# EAGLE schematic qPCR_pcb_breakout_LME49721MAX:NOPB (EAGLE 9.6.1)
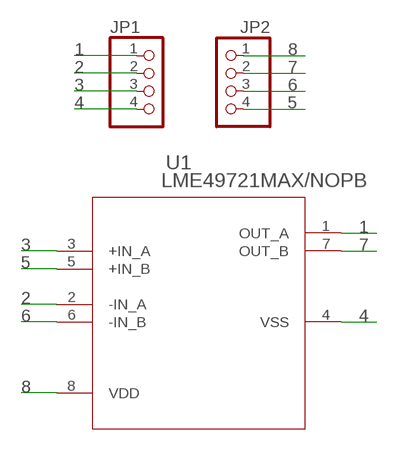
[diagram p0: schematic, sheet 1]

## Parts
JP1  PINHD-1X4  [1X04]
JP2  PINHD-1X4  [1X04]
U1  LME49721MAX/NOPB  [M08A_TEX]

## Nets
1: JP1.1 U1.1(OUT_A)
2: JP1.2 U1.2(-IN_A)
3: JP1.3 U1.3(+IN_A)
4: JP1.4 U1.4(VSS)
5: JP2.4 U1.5(+IN_B)
6: JP2.3 U1.6(-IN_B)
7: JP2.2 U1.7(OUT_B)
8: JP2.1 U1.8(VDD)

## Library data of the parts
JP1 JP2 = pinhead:PINHD-1X4: PIN HEADER
U1 = Ninja_qPCR:LME49721MAX/NOPB; BUILT_BY: EMA_UL_Team; MANUFACTURER_PART_NUMBER: LME49721MAX/NOPB; SOURCELIBRARY: National_2014-06-20; VENDOR: Texas Instruments